# Altium schematic sheet DSO_Front.SchDoc: Digital Storage Oscilloscope
size A4; CompanyName: University of Melbourne; DrawnBy: Lei Qin; Engineer: Your Name Here; DocumentNumber: 1; Revision: 0.1; SheetNumber: 1; SheetTotal: 1; StudentNo: Student No.
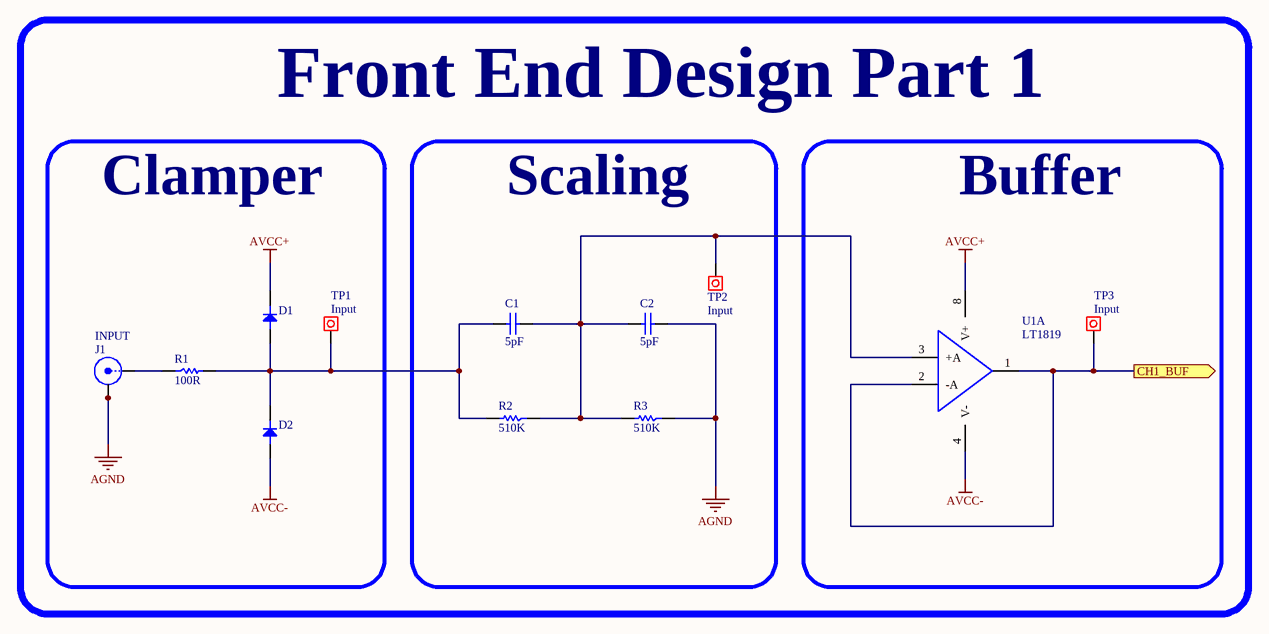
[diagram p0: DSO_Front.SchDoc]

## Parts
C1  5pF  [0805C]
C2  5pF  [0805C]
D1  Diode  [SOD-123]  (value not drawn)
D2  Diode  [SOD-123]  (value not drawn)
J1  INPUT  [BNC_VERT]
R1  100R  [0805]
R2  510K  [0805]
R3  510K  [0805]
TP1  INPUT  [Testpoin]
TP2  INPUT  [Testpoin]
TP3  INPUT  [Testpoin]
U1  LT1819  [SOIC-8]  (part A of 2)

## Blocks framed on the sheet
Clamper: D1 D2 J1 R1 TP1
Scaling: C1 C2 R2 R3 TP2
Buffer: TP3 U1

## Ports
CH1_BUF (out)

## Nets
AGND: C2.1 J1.2(Y) J1.3(Y) J1.4(Y) J1.5(Y) R3.1
AVCC+: D1.K U1.8(V+)
AVCC-: D2.A U1.4(V-)
CH1_BUF: TP3.1 U1.1(OUTA) U1.2(-A) ; port CH1_BUF
NetC1_1: C1.1 C2.2 R2.1 R3.2 TP2.1 U1.3(+A)
NetC1_2: C1.2 D1.A D2.K R1.2 R2.2 TP1.1
NetJ1_1: J1.1(X) R1.1

## Notes on the sheet
- Front End Design Part 1

## Library data of the parts
C1 C2 = C: Capacitor; Reviewed by: RM - 2018/08/05; Revision: July-2002: Re-released for DXP Platform.; Supplier 1: *; Supplier Part Number 1: *; Value: 5pF
D1 D2 = D: Reviewed by: RM - 2018/08/05; Revision: July-2002: Re-released for DXP Platform.; Supplier 1: *; Supplier Part Number 1: *
J1 = BNC: BNC Straight; Reviewed by: RM - 2018/08/05; Supplier Part Number 1: A97581-ND; Supplier 1: Digi-Key
R1-R3 = R: Resistor; Reviewed by: RM - 2018/08/05; Supplier 1: *; Suppler Part Number 1: *
  R1: Value: 100R
  R2 R3: Value: 510K
TP1-TP3 = Test Point: Pad; Value: Input
U1 = LT1819: OpAmp High Frequency Dual; Reviewed by: RM - 2018/08/05; Supplier 1: Digi-Key; Supplier Part Number 1: LT1819CMS8#PBF-ND